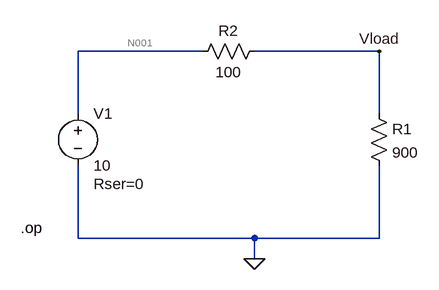
[diagram p0: schematic Experiment 1.asc]
Experiment 1.asc, the LTspice schematic file:
Version 4
SHEET 1 880 680
WIRE 272 0 80 0
WIRE 544 0 352 0
WIRE 80 96 80 0
WIRE 544 96 544 0
WIRE 80 288 80 176
WIRE 352 288 80 288
WIRE 544 288 544 176
WIRE 544 288 352 288
WIRE 352 320 352 288
FLAG 352 320 0
FLAG 544 0 Vload
SYMBOL voltage 80 80 R0
WINDOW 123 0 0 Left 0
WINDOW 39 24 124 Left 2
SYMATTR InstName V1
SYMATTR Value 10
SYMATTR SpiceLine Rser=0
SYMBOL res 528 80 R0
SYMATTR InstName R1
SYMATTR Value 900
SYMBOL res 368 -16 R90
WINDOW 0 0 56 VBottom 2
WINDOW 3 32 56 VTop 2
SYMATTR InstName R2
SYMATTR Value 100
TEXT -8 272 Left 2 !.op

The netlist it stands for:
* Experiment 1.asc
V1 N001 0 10 Rser=0
R1 Vload 0 900
R2 Vload N001 100
.op
.backanno
.end

* Results of the author's LTspice run, read from the files saved beside the schematic
* Operating Point:
*   V(n001) = 10 V
*   V(vload) = 9 V
*   I(R2) = -10 mA
*   I(R1) = 10 mA
*   I(V1) = -10 mA